# EAGLE design SRAM_MODULE 1.0 (EAGLE 7.1.0)
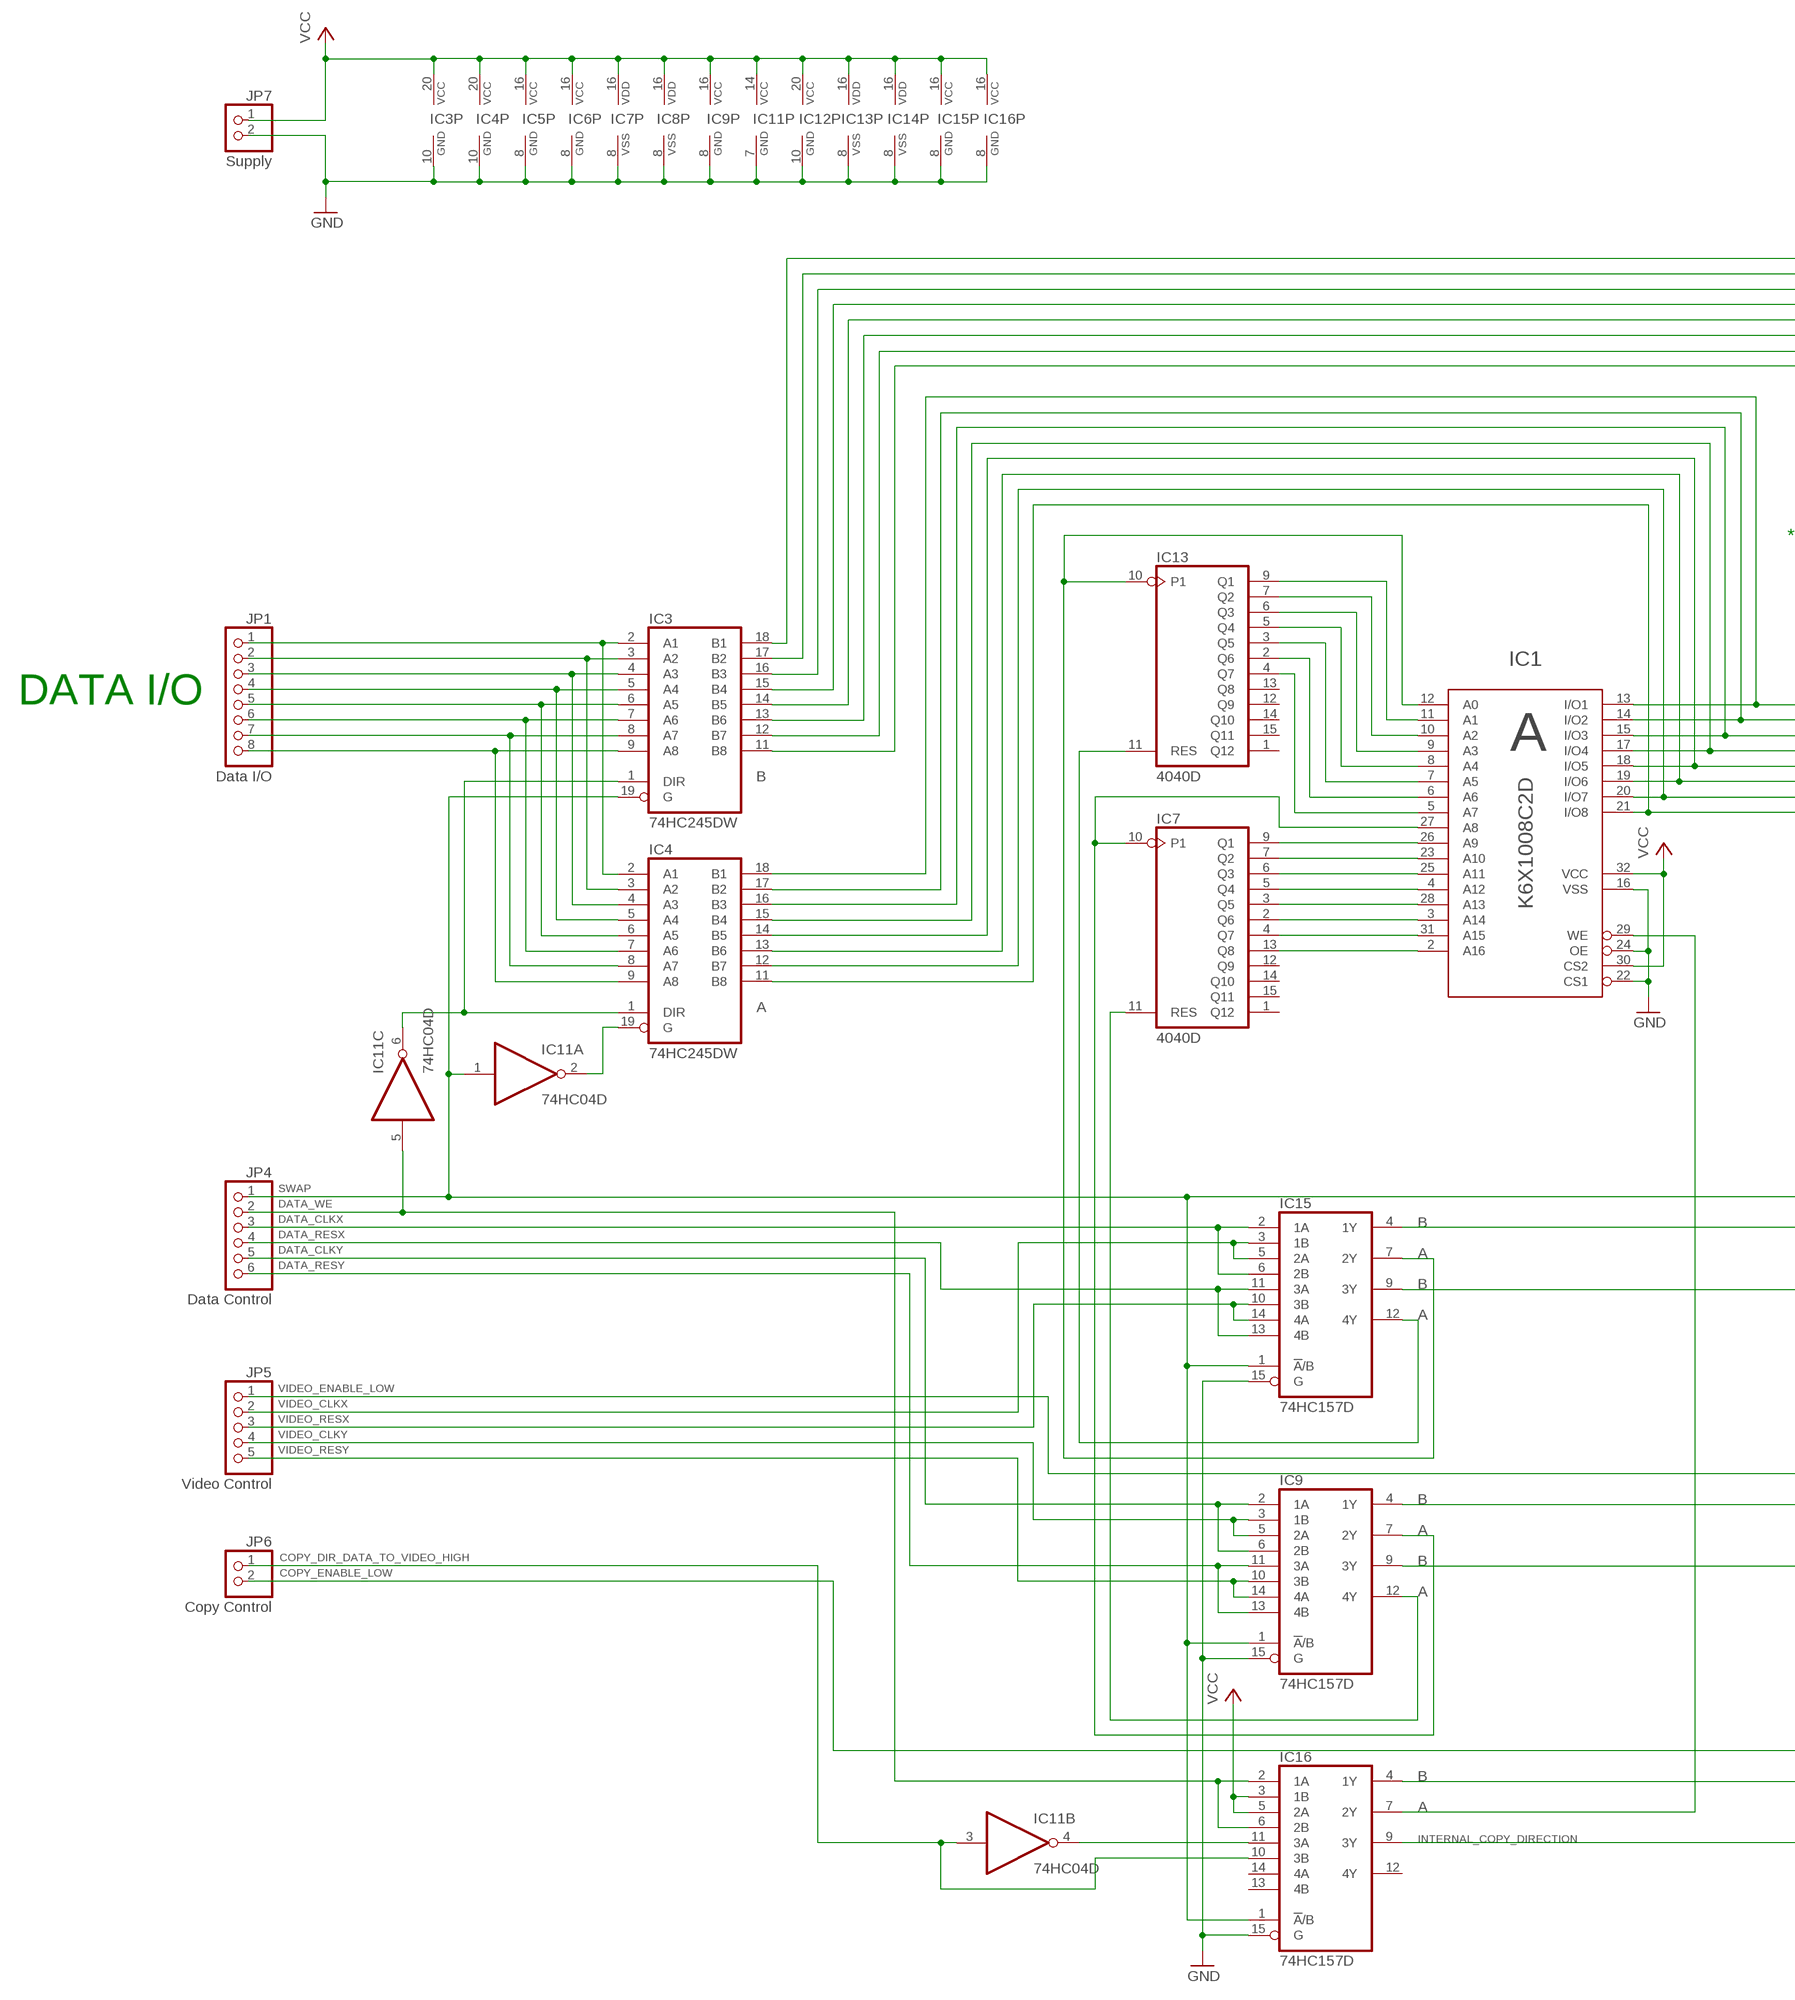
[diagram p0: schematic, sheet 1, part 1 of 2]
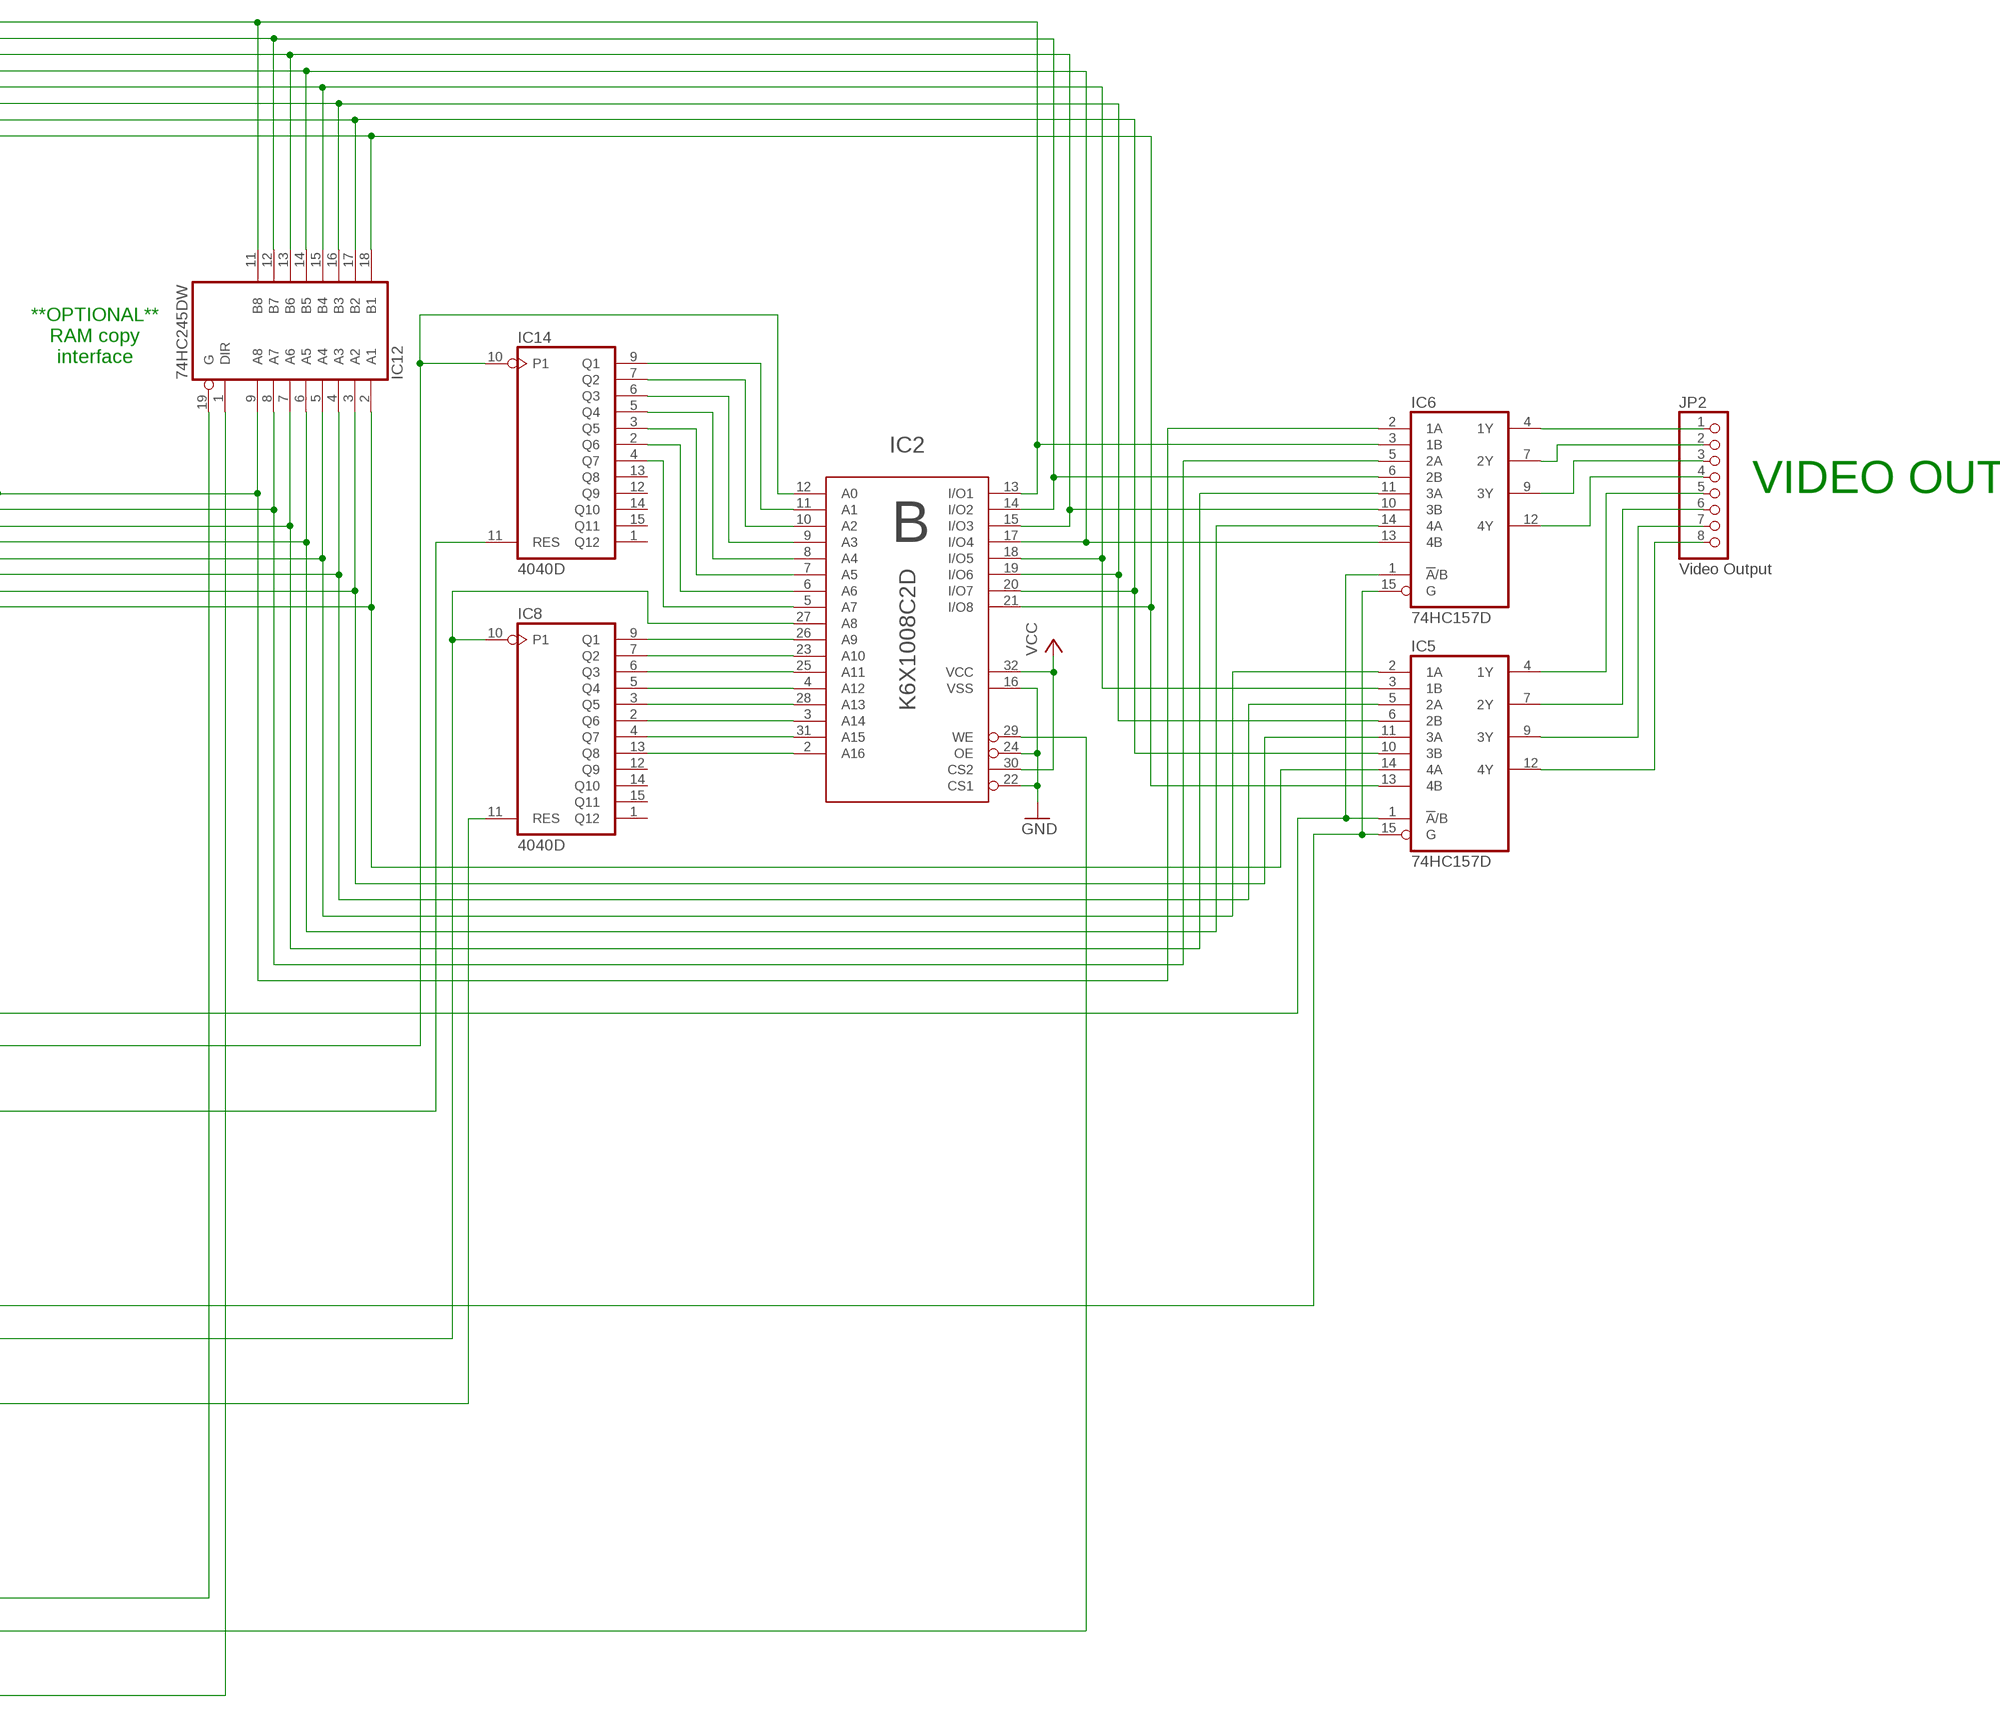
[diagram p1: schematic, sheet 1, part 2 of 2]

## Parts
IC1  K6X1008C2D  [SOP32-5]
IC2  K6X1008C2D  [SOP32-5]
IC3  74HC245DW  [SO20W]
IC4  74HC245DW  [SO20W]
IC5  74HC157D  [SO16]
IC6  74HC157D  [SO16]
IC7  4040D  [SO16]
IC8  4040D  [SO16]
IC9  74HC157D  [SO16]
IC11  74HC04D  [SO14]
IC12  74HC245DW  [SO20W]
IC13  4040D  [SO16]
IC14  4040D  [SO16]
IC15  74HC157D  [SO16]
IC16  74HC157D  [SO16]
JP1  Data I/O  PINHD-1X8  [1X08]
JP2  Video Output  PINHD-1X8  [1X08]
JP4  Data Control  PINHD-1X6  [1X06]
JP5  Video Control  PINHD-1X5  [1X05]
JP6  Copy Control  PINHD-1X2  [1X02]
JP7  Supply  PINHD-1X2  [1X02]

## Nets
A_I/O1: IC1.13(I/O1) IC4.18(B1) IC6.2(1A) IC12.9(A8)
A_I/O2: IC1.14(I/O2) IC4.17(B2) IC6.5(2A) IC12.8(A7)
A_I/O3: IC1.15(I/O3) IC4.16(B3) IC6.11(3A) IC12.7(A6)
A_I/O4: IC1.17(I/O4) IC4.15(B4) IC6.14(4A) IC12.6(A5)
A_I/O5: IC1.18(I/O5) IC4.14(B5) IC5.2(1A) IC12.5(A4)
A_I/O6: IC1.19(I/O6) IC4.13(B6) IC5.5(2A) IC12.4(A3)
A_I/O7: IC1.20(I/O7) IC4.12(B7) IC5.11(3A) IC12.3(A2)
A_I/O8: IC1.21(I/O8) IC4.11(B8) IC5.14(4A) IC12.2(A1)
B_I/O1: IC2.13(I/O1) IC3.18(B1) IC6.3(1B) IC12.11(B8)
B_I/O2: IC2.14(I/O2) IC3.17(B2) IC6.6(2B) IC12.12(B7)
B_I/O3: IC2.15(I/O3) IC3.16(B3) IC6.10(3B) IC12.13(B6)
B_I/O4: IC2.17(I/O4) IC3.15(B4) IC6.13(4B) IC12.14(B5)
B_I/O5: IC2.18(I/O5) IC3.14(B5) IC5.3(1B) IC12.15(B4)
B_I/O6: IC2.19(I/O6) IC3.13(B6) IC5.6(2B) IC12.16(B3)
B_I/O7: IC2.20(I/O7) IC3.12(B7) IC5.10(3B) IC12.17(B2)
B_I/O8: IC2.21(I/O8) IC3.11(B8) IC5.13(4B) IC12.18(B1)
COPY_DIR_DATA_TO_VIDEO_HIGH: IC11.3(B:I) IC16.10(3B) JP6.1
COPY_ENABLE_LOW: IC12.19(G) JP6.2
DATA_CLKX: IC15.2(1A) IC15.6(2B) JP4.3
DATA_CLKY: IC9.2(1A) IC9.6(2B) JP4.5
DATA_RESX: IC15.11(3A) IC15.13(4B) JP4.4
DATA_RESY: IC9.11(3A) IC9.13(4B) JP4.6
DATA_RESY1: IC11.4(B:O) IC16.11(3A)
DATA_WE: IC11.5(C:I) IC16.2(1A) IC16.6(2B) JP4.2
GND: IC1.16(VSS) IC1.22(CS1) IC1.24(OE) IC2.16(VSS) IC2.22(CS1) IC2.24(OE) IC3.10(GND) IC4.10(GND) IC5.8(GND) IC6.8(GND) IC7.8(VSS) IC8.8(VSS) IC9.8(GND) IC9.15(G) IC11.7(P:GND) IC12.10(GND) IC13.8(VSS) IC14.8(VSS) IC15.8(GND) IC15.15(G) IC16.8(GND) IC16.15(G) JP7.2
INTERNAL_COPY_DIRECTION: IC12.1(DIR) IC16.9(3Y)
IO1: IC3.2(A1) IC4.2(A1) JP1.1
IO2: IC3.3(A2) IC4.3(A2) JP1.2
IO3: IC3.4(A3) IC4.4(A3) JP1.3
IO4: IC3.5(A4) IC4.5(A4) JP1.4
IO5: IC3.6(A5) IC4.6(A5) JP1.5
IO6: IC3.7(A6) IC4.7(A6) JP1.6
IO7: IC3.8(A7) IC4.8(A7) JP1.7
IO8: IC3.9(A8) IC4.9(A8) JP1.8
N$17: IC2.25(A11) IC8.6(Q3)
N$18: IC2.23(A10) IC8.7(Q2)
N$19: IC2.4(A12) IC8.5(Q4)
N$20: IC2.26(A9) IC8.9(Q1)
N$21: IC1.12(A0) IC13.10(P1) IC15.7(2Y)
N$22: IC2.3(A14) IC8.2(Q6)
N$23: IC2.28(A13) IC8.3(Q5)
N$24: IC2.31(A15) IC8.4(Q7)
N$25: IC2.2(A16) IC8.13(Q8)
N$26: IC1.25(A11) IC7.6(Q3)
N$27: IC1.27(A8) IC7.10(P1) IC9.7(2Y)
N$28: IC1.4(A12) IC7.5(Q4)
N$31: IC1.3(A14) IC7.2(Q6)
N$32: IC1.28(A13) IC7.3(Q5)
N$33: IC1.31(A15) IC7.4(Q7)
N$34: IC1.2(A16) IC7.13(Q8)
N$35: IC7.11(RES) IC9.12(4Y)
N$36: IC8.11(RES) IC9.9(3Y)
N$37: IC1.9(A3) IC13.6(Q3)
N$38: IC2.27(A8) IC8.10(P1) IC9.4(1Y)
N$39: IC1.26(A9) IC7.9(Q1)
N$40: IC1.29(WE) IC16.7(2Y)
N$41: IC1.23(A10) IC7.7(Q2)
N$43: IC3.1(DIR) IC4.1(DIR) IC11.6(C:O)
N$45: IC4.19(G) IC11.2(A:O)
N$47: IC2.29(WE) IC16.4(1Y)
N$71: IC1.11(A1) IC13.9(Q1)
N$73: IC1.8(A4) IC13.5(Q4)
N$74: IC1.7(A5) IC13.3(Q5)
N$75: IC1.6(A6) IC13.2(Q6)
N$76: IC1.5(A7) IC13.4(Q7)
N$77: IC1.10(A2) IC13.7(Q2)
N$78: IC2.12(A0) IC14.10(P1) IC15.4(1Y)
N$79: IC2.11(A1) IC14.9(Q1)
N$80: IC2.10(A2) IC14.7(Q2)
N$81: IC2.9(A3) IC14.6(Q3)
N$82: IC2.8(A4) IC14.5(Q4)
N$83: IC2.7(A5) IC14.3(Q5)
N$84: IC2.6(A6) IC14.2(Q6)
N$85: IC2.5(A7) IC14.4(Q7)
N$87: IC14.11(RES) IC15.9(3Y)
N$88: IC13.11(RES) IC15.12(4Y)
O1: IC6.4(1Y) JP2.1
O2: IC6.7(2Y) JP2.2
O3: IC6.9(3Y) JP2.3
O4: IC6.12(4Y) JP2.4
O5: IC5.4(1Y) JP2.5
O6: IC5.7(2Y) JP2.6
O7: IC5.9(3Y) JP2.7
O8: IC5.12(4Y) JP2.8
SWAP: IC3.19(G) IC5.1(!A!/B) IC6.1(!A!/B) IC9.1(!A!/B) IC11.1(A:I) IC15.1(!A!/B) IC16.1(!A!/B) JP4.1
VCC: IC1.30(CS2) IC1.32(VCC) IC2.30(CS2) IC2.32(VCC) IC3.20(VCC) IC4.20(VCC) IC5.16(VCC) IC6.16(VCC) IC7.16(VDD) IC8.16(VDD) IC9.16(VCC) IC11.14(P:VCC) IC12.20(VCC) IC13.16(VDD) IC14.16(VDD) IC15.16(VCC) IC16.3(1B) IC16.5(2A) IC16.16(VCC) JP7.1
VIDEO_CLKX: IC15.3(1B) IC15.5(2A) JP5.2
VIDEO_CLKY: IC9.3(1B) IC9.5(2A) JP5.4
VIDEO_ENABLE_LOW: IC5.15(G) IC6.15(G) JP5.1
VIDEO_RESX: IC15.10(3B) IC15.14(4A) JP5.3
VIDEO_RESY: IC9.10(3B) IC9.14(4A) JP5.5
Unconnected: IC7.1(Q12) IC7.12(Q9) IC7.14(Q10) IC7.15(Q11) IC8.1(Q12) IC8.12(Q9) IC8.14(Q10) IC8.15(Q11) IC11.8(D:O) IC11.9(D:I) IC11.10(E:O) IC11.11(E:I) IC11.12(F:O) IC11.13(F:I) IC13.1(Q12) IC13.12(Q9) IC13.13(Q8) IC13.14(Q10) IC13.15(Q11) IC14.1(Q12) IC14.12(Q9) IC14.13(Q8) IC14.14(Q10) IC14.15(Q11) IC16.12(4Y) IC16.13(4B) IC16.14(4A)

## Notes on the sheet
- **OPTIONAL**
  RAM copy
  interface
- DATA I/O | VIDEO OUT
- A | B
- B
- A
- B
- A
- B
- A
- B
- A
- B
- A
- B
- A

## Library data of the parts
IC1 IC2 = SRAM:K6X1008C2D: Static RAM SOP32-5; IC1: K6X1008C2D-B
IC3 IC4 IC12 = 74xx-eu:74*245: Octal BUS TRANSCEIVER, 3-state
IC5 IC6 IC9 IC15 IC16 = 74xx-eu:74*157: Quadruple 2-line to 1-line data SELECTOR/MULTIPLEXER
IC7 IC8 IC13 IC14 = 40xx:4040: 12-stage binary/ripple COUNTER
IC11 = 74xx-eu:74*04: Hex INVERTER
JP1 JP2 = pinhead:PINHD-1X8: PIN HEADER
JP4 = pinhead:PINHD-1X6: PIN HEADER
JP5 = pinhead:PINHD-1X5: PIN HEADER
JP6 JP7 = pinhead:PINHD-1X2: PIN HEADER

## Board
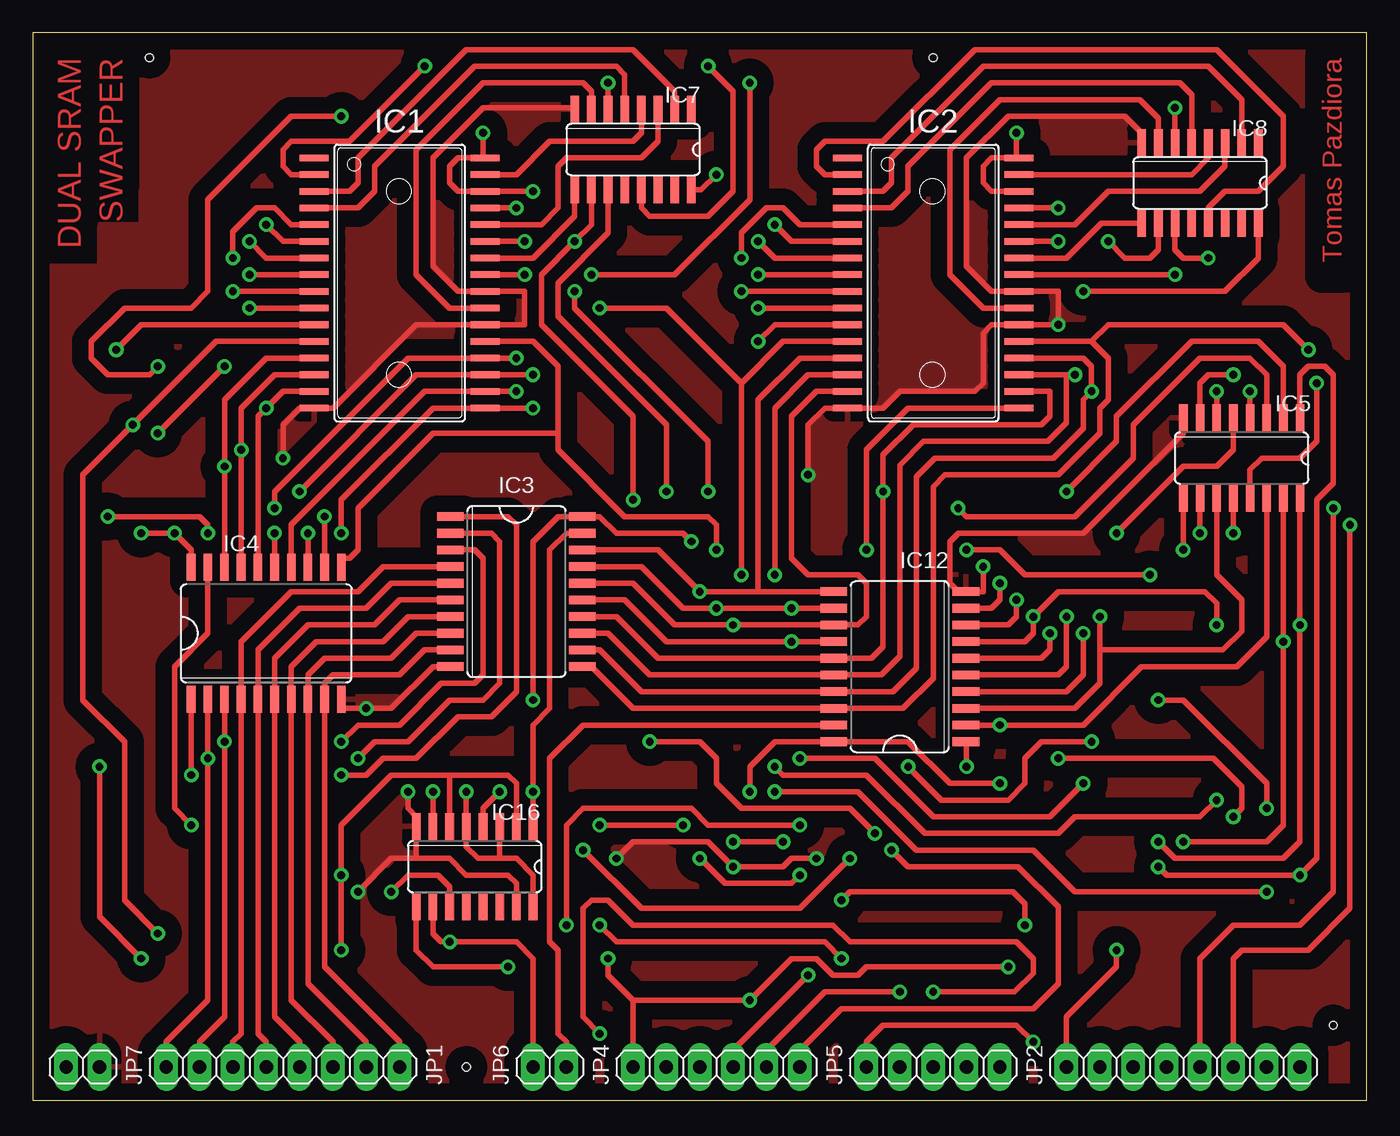
[diagram p2: board, top side]
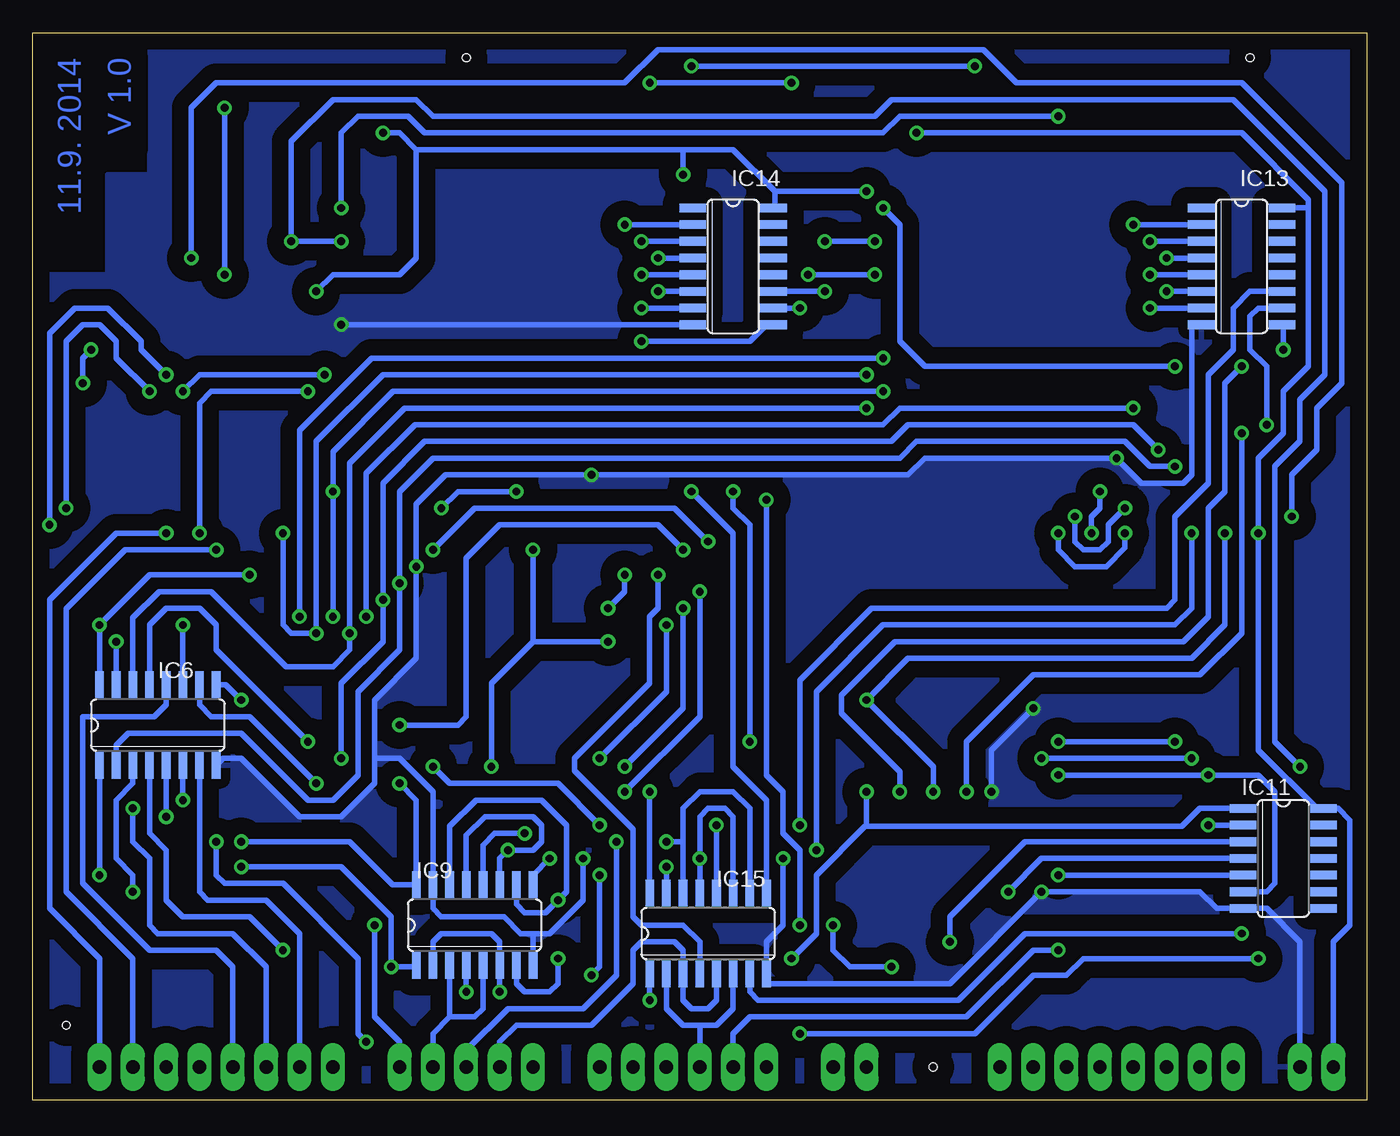
[diagram p3: board, bottom side, seen from below]

Size 101.6 x 81.28 mm. Coordinates in mm from the lower left corner, seen from the top.
Outline: 0,0 101.6,0 101.6,81.28 0,81.28 0,0
Copper layers (1*16): Top 0.035mm / dielectric 1.5mm / Bottom 0.035mm
Design rules "Aroidzap_DesignRules": minimum track width 16mil, minimum drill 0.6mm, track to track 20mil, track to pad 20mil, pad to pad 20mil, via to via 20mil, smd to smd 16mil, copper to edge 20mil, drill to drill 40mil, minimum pad ring 16mil, minimum via ring 10mil, stop-mask expansion 4mil, vias tented up to drill 0mil, thermal gap 30mil
Holes 0.6 mm at 8.89,79.38 68.58,79.38 99.06,5.71 33.02,2.54

### Footprints (pad centres in the part's own frame; a part is rotated, then mirrored left to right if it is on the bottom)
SOP32-5 = smd 0.5 x 2.2: 1 -9.525,-6.516; 2 -8.255,-6.516; 3 -6.985,-6.516; 4 -5.715,-6.516; 5 -4.445,-6.516; 6 -3.175,-6.516; 7 -1.905,-6.516; 8 -0.635,-6.516; 9 0.635,-6.516; 10 1.905,-6.516; 11 3.175,-6.516; 12 4.445,-6.516; 13 5.715,-6.516; 14 6.985,-6.516; 15 8.255,-6.516; 16 9.525,-6.516; 17 9.525,6.516; 18 8.255,6.516; 19 6.985,6.516; 20 5.715,6.516; 21 4.445,6.516; 22 3.175,6.516; 23 1.905,6.516; 24 0.635,6.516; 25 -0.635,6.516; 26 -1.905,6.516; 27 -3.175,6.516; 28 -4.445,6.516; 29 -5.715,6.516; 30 -6.985,6.516; 31 -8.255,6.516; 32 -9.525,6.516
SO20W = smd 0.66 x 2.032: 1 -5.715,-5.029; 2 -4.445,-5.029; 3 -3.175,-5.029; 4 -1.905,-5.029; 5 -0.635,-5.029; 6 0.635,-5.029; 7 1.905,-5.029; 8 3.175,-5.029; 9 4.445,-5.029; 10 5.715,-5.029; 11 5.715,5.029; 12 4.445,5.029; 13 3.175,5.029; 14 1.905,5.029; 15 0.635,5.029; 16 -0.635,5.029; 17 -1.905,5.029; 18 -3.175,5.029; 19 -4.445,5.029; 20 -5.715,5.029
SO16 = smd 0.66 x 2.032: 1 -4.445,-3.073; 2 -3.175,-3.073; 3 -1.905,-3.073; 4 -0.635,-3.073; 5 0.635,-3.073; 6 1.905,-3.073; 7 3.175,-3.073; 8 4.445,-3.073; 9 4.445,3.073; 10 3.175,3.073; 11 1.905,3.073; 12 0.635,3.073; 13 -0.635,3.073; 14 -1.905,3.073; 15 -3.175,3.073; 16 -4.445,3.073
SO14 = smd 0.66 x 2.032: 1 -3.81,-3.073; 2 -2.54,-3.073; 3 -1.27,-3.073; 4 0,-3.073; 5 1.27,-3.073; 6 2.54,-3.073; 7 3.81,-3.073; 8 3.81,3.073; 9 2.54,3.073; 10 1.27,3.073; 11 0,3.073; 12 -1.27,3.073; 13 -2.54,3.073; 14 -3.81,3.073
1X08 = drill 1.016 long: 1 -8.89,0; 2 -6.35,0; 3 -3.81,0; 4 -1.27,0; 5 1.27,0; 6 3.81,0; 7 6.35,0; 8 8.89,0
1X06 = drill 1.016 long: 1 -6.35,0; 2 -3.81,0; 3 -1.27,0; 4 1.27,0; 5 3.81,0; 6 6.35,0
1X05 = drill 1.016 long: 1 -5.08,0; 2 -2.54,0; 3 0,0; 4 2.54,0; 5 5.08,0
1X02 = drill 1.016 long: 1 -1.27,0; 2 1.27,0

### Placement (x,y rotation side)
IC1  27.94,62.23 270 top
IC2  68.58,62.23 270 top
IC3  36.83,38.73 270 top
IC4  17.78,35.56 0 top
IC5  92.08,48.9 180 top
IC6  92.08,28.57 0 bottom
IC7  45.72,72.39 180 top
IC8  88.9,69.85 180 top
IC9  67.94,13.34 0 bottom
IC11  6.35,18.41 270 bottom
IC12  66.04,33.02 90 top
IC13  9.53,63.5 270 bottom
IC14  48.26,63.5 270 bottom
IC15  50.16,12.7 0 bottom
IC16  33.66,17.78 180 top
JP1  19.05,2.54 0 top
JP2  87.63,2.54 0 top
JP4  52.07,2.54 0 top
JP5  68.58,2.54 0 top
JP6  39.37,2.54 0 top
JP7  3.81,2.54 0 top

### Tracks (layer width: path | path; a pad name or v marks a point on that pad's centre or on a via)
A_I/O1  (via drill 0.6 pad 0.61)
  Top 0.406: IC4.18 v14.61,48.26 14.61,53.34 17.78,56.52 IC1.13 | IC12.9 73.03,37.47 73.66,38.1 v73.66,39.37
  Bottom 0.406: v14.61,48.26 16.51,48.26 18.41,50.16 34.29,50.16 35.56,48.9 71.12,48.9 73.66,46.35 v73.66,39.37 73.66,34.29 76.83,31.11 76.83,24.77 78.74,22.86 80.64,22.86 85.72,27.94 94.35,27.94 95.25,27.04 IC6.2
A_I/O2  (via drill 0.6, 0.6 pad 0.61)
  Top 0.406: IC1.14 18.41,55.24 15.88,52.7 v15.88,49.53 IC4.17 | IC12.8 74.3,36.2 74.93,36.83 v74.93,38.1 | v91.44,21.59 92.08,22.23 92.08,23.87 89.91,26.04 v78.11,26.04
  Bottom 0.406: v15.88,49.53 17.78,51.44 34.92,51.44 36.2,50.16 71.75,50.16 74.93,46.99 v74.93,38.1 74.93,34.92 78.11,31.75 v78.11,26.04 | IC6.5 v91.44,21.59
A_I/O3  (via drill 0.6, 0.6 pad 0.61)
  Top 0.406: IC1.15 19.05,53.98 v17.78,52.7 17.14,52.07 IC4.16 | IC12.7 75.56,34.92 76.2,35.56 v76.2,36.83 78.11,38.73 89.27,38.73 90.17,37.84 v90.17,36.2
  Bottom 0.406: v76.2,36.83 76.2,47.73 72.5,51.44 36.83,51.44 35.56,52.7 v17.78,52.7 | IC6.11 v90.17,36.2
A_I/O4  (via drill 0.6, 0.6 pad 0.61)
  Top 0.406: v23.5,43.18 23.5,45.72 30.48,52.7 IC1.17 v38.1,52.7 | v18.41,43.18 IC4.15 | IC12.6 76.83,33.66 77.47,34.29 v77.47,35.56
  Bottom 0.406: v18.41,43.18 18.41,42.06 19.84,40.64 22.23,40.64 23.5,41.91 v23.5,43.18 | IC6.14 93.98,36.73 91.97,38.73 88,38.73 82.29,33.02 78.74,33.02 77.47,34.29 v77.47,35.56 77.47,48.51 73.28,52.7 v38.1,52.7
A_I/O5  (via drill 0.6, 0.6 pad 0.61)
  Top 0.406: IC4.14 19.68,43.81 29.84,53.98 IC1.18 v36.83,53.98 | IC12.5 78.11,32.38 78.74,33.02 v78.74,36.83 | IC5.2 95.25,55.88 93.34,57.78 88.27,57.78 82.55,52.07 82.55,50.16 v78.74,46.35
  Bottom 0.406: v78.74,36.83 v78.74,46.35 78.74,49.38 74.14,53.98 v36.83,53.98
A_I/O6  (via drill 0.6, 0.6 pad 0.61)
  Top 0.406: v20.95,43.18 IC4.13 | v20.32,46.35 29.21,55.24 IC1.19 v38.1,55.24 | IC12.4 78.74,31.11 80.01,32.38 v80.01,35.56 | IC5.5 91.44,49.53 90.17,48.26 87.63,48.26 v82.55,43.18
  Bottom 0.406: v20.95,43.18 20.95,44.45 20.32,45.09 v20.32,46.35 | v82.55,43.18 82.55,36.2 81.92,35.56 v80.01,35.56 80.01,50.16 74.93,55.24 v38.1,55.24
A_I/O7  (via drill 0.6 pad 0.61)
  Top 0.406: v18.41,45.09 18.41,46.35 28.57,56.52 IC1.20 v36.83,56.52 | IC4.12 v22.23,44.45 | IC12.3 79.38,29.84 81.28,31.75 81.28,34.29 | v81.28,36.83 81.28,34.29 | IC5.11 90.17,40.01 92.08,38.1 92.08,35.71 90.66,34.29 81.28,34.29
  Bottom 0.406: v81.28,36.83 81.28,51.02 75.78,56.52 v36.83,56.52 | v18.41,45.09 19.68,43.81 19.68,42.55 20.32,41.91 21.59,41.91 22.23,42.55 v22.23,44.45
A_I/O8  (via drill 0.6)
  Top 0.406: IC1.21 38.1,57.78 40.01,55.88 40.01,50.8 | 40.01,50.8 30.48,50.8 24.77,45.09 24.77,41.91 24.13,41.27 23.5,41.27 IC4.11 | IC5.14 93.98,35.31 91.69,33.02 84.45,33.02 80.01,28.57 v73.66,28.57 IC12.2 | v52.07,41.91 52.07,43.81 51.44,44.45 45.09,44.45 40.01,49.53 40.01,50.8
  Bottom 0.406: v73.66,28.57 69.22,28.57 68.58,29.21 68.58,41.27 66.04,43.81 53.98,43.81 v52.07,41.91
B_I/O1  (via drill 0.6)
  Top 0.406: IC3.18 47.62,41.91 v50.8,38.73 55.24,38.73 | IC2.13 58.42,56.52 55.24,53.34 55.24,38.73 | 55.24,38.73 IC12.11 | v56.52,23.5 62.87,23.5 67.31,19.05 76.2,19.05 79.38,15.88 v93.98,15.88
  Bottom 0.406: IC6.3 93.98,24.13 95.25,22.86 95.25,18.41 93.98,17.14 v93.98,15.88 | v56.52,23.5 50.8,29.21 v50.8,38.73
B_I/O2  (via drill 0.6, 0.6 pad 0.61)
  Top 0.406: IC3.17 46.35,40.64 49.53,37.47 v52.07,37.47 v57.78,37.47 IC12.12 | IC2.14 59.05,55.24 56.52,52.7 v56.52,40.01 | v90.17,22.86 88.9,21.59 79.38,21.59 78.11,20.32 67.94,20.32 63.5,24.77 57.15,24.77 v56.52,25.4
  Bottom 0.406: v56.52,40.01 56.52,38.73 v57.78,37.47 | IC6.6 v90.17,22.86 | v56.52,25.4 52.07,29.84 v52.07,37.47
B_I/O3  (via drill 0.6)
  Top 0.406: IC3.16 45.72,39.37 48.9,36.2 v53.34,36.2 IC12.13 62.87,36.2 63.5,36.83 63.5,39.37 62.87,40.01 59.05,40.01 57.78,41.27 57.78,52.07 59.69,53.98 IC2.15 | v80.01,24.13 77.47,21.59 68.58,21.59 64.14,26.04 v58.42,26.04
  Bottom 0.406: IC6.10 88.9,30.11 88,29.21 85.09,29.21 v80.01,24.13 | v58.42,26.04 53.34,31.11 v53.34,36.2
B_I/O4  (via drill 0.6)
  Top 0.406: IC3.15 45.09,38.1 48.26,34.92 v57.78,34.92 IC12.14 | IC2.17 66.67,52.7 63.5,49.53 v63.5,41.91 | v66.67,25.4 69.22,22.86 74.3,22.86 75.56,24.13 75.56,26.04 76.83,27.3 v80.64,27.3
  Bottom 0.406: v63.5,41.91 63.5,34.92 | 63.5,34.92 v57.78,34.92 | 63.5,34.92 66.67,31.75 v66.67,25.4 | IC6.13 92.71,36.2 91.44,37.47 88.9,37.47 87.63,36.2 87.63,34.29 v80.64,27.3
B_I/O5  (via drill 0.6)
  Top 0.406: IC3.14 44.45,36.83 47.62,33.66 IC12.15 63.87,33.66 64.77,34.55 v64.77,46.35 64.77,49.15 67.06,51.44 76.83,51.44 77.47,52.07 77.47,53.98 IC2.18 | IC5.3 93.98,55.24 92.71,56.52 88.9,56.52 83.82,51.44 83.82,48.9 79.38,44.45 71.12,44.45 v70.48,45.09
  Bottom 0.406: v70.48,45.09 69.22,46.35 v64.77,46.35
B_I/O6  (via drill 0.6)
  Top 0.406: IC3.13 43.81,35.56 46.99,32.38 IC12.16 64.62,32.38 66.04,33.8 66.04,48.37 67.84,50.16 77.32,50.16 78.74,51.59 78.74,55.24 v79.38,55.24 IC2.19 | 90.17,51.44 IC5.6 v90.17,53.98
  Bottom 0.406: v90.17,53.98 88.9,55.24 v79.38,55.24
B_I/O7  (via drill 0.6)
  Top 0.406: IC3.12 43.18,34.29 46.35,31.11 IC12.17 65.51,31.11 67.31,32.91 67.31,47.48 68.73,48.9 77.72,48.9 80.01,51.19 80.01,53.34 v80.64,53.98 80.64,55.88 80.01,56.52 IC2.20 | IC5.10 v88.9,43.18
  Bottom 0.406: v88.9,43.18 88.9,53.08 88,53.98 v80.64,53.98
B_I/O8  (via drill 0.6)
  Top 0.406: IC3.11 42.55,33.02 45.72,29.84 IC12.18 66.29,29.84 68.58,32.13 68.58,46.73 69.48,47.62 78.11,47.62 81.28,50.8 81.28,52.7 81.92,53.34 81.92,56.52 80.64,57.78 | IC5.13 92.71,48 93.61,48.9 96.52,48.9 97.79,50.16 v97.79,54.61 | v97.16,57.15 95.25,59.05 81.92,59.05 80.64,57.78 | IC2.21 80.64,57.78
  Bottom 0.406: v97.79,54.61 97.79,56.52 v97.16,57.15
COPY_DIR_DATA_TO_VIDEO_HIGH  (via drill 0.6)
  Top 0.406: IC16.10 30.48,12.7 31.11,12.06 v31.75,12.06 36.83,12.06 38.1,10.79 JP6.1
  Bottom 0.406: IC11.3 26.04,19.68 31.75,13.97 v31.75,12.06
COPY_ENABLE_LOW
  Top 0.406: JP6.2 40.64,4.45 40.01,5.08 40.01,11.43 39.37,12.06 39.37,26.04 41.91,28.57 IC12.19
DATA_CLKX
  Bottom 0.406: IC15.6 48.26,6.99 49.53,5.71 50.8,5.71 | 50.8,5.71 52.07,5.71 53.34,6.99 IC15.2 | JP4.3 50.8,5.71
DATA_CLKY  (via drill 0.6)
  Top 0.406: JP4.5 55.88,3.81 60.33,8.26 v66.04,8.26
  Bottom 0.406: v66.04,8.26 IC9.6 66.04,12.06 66.67,12.7 70.48,12.7 71.12,12.06 IC9.2
DATA_RESX  (via drill 0.6)
  Top 0.406: v50.8,18.41 52.7,16.51 57.78,16.51 v58.42,17.14 | JP4.4 53.34,3.81 v59.05,9.53
  Bottom 0.406: IC15.11 48.26,21.59 48.9,22.23 50.16,22.23 50.8,21.59 v50.8,18.41 IC15.13 | v58.42,17.14 58.42,10.16 v59.05,9.53
DATA_RESY  (via drill 0.6)
  Top 0.406: v65.41,19.05 66.67,17.78 75.05,17.78 78.11,14.72 78.11,8.89 76.2,6.99 61.59,6.99 58.42,3.81 JP4.6
  Bottom 0.406: IC9.13 68.58,20.17 67.16,21.59 63.5,21.59 62.87,20.95 62.87,19.68 63.5,19.05 v65.41,19.05 66.04,18.41 IC9.11
DATA_RESY1  (via drill 0.6)
  Top 0.406: IC16.11 31.75,16.25 30.85,17.14 28.57,17.14 v27.3,15.88
  Bottom 0.406: IC11.4 24.77,18.41 v27.3,15.88
DATA_WE  (via drill 0.6)
  Top 0.406: 31.75,24.77 27.3,24.77 23.5,20.95 v23.5,17.14 v23.5,11.43 | 31.75,24.77 IC16.6 | IC16.2 36.83,24.13 36.2,24.77 31.75,24.77
  Bottom 0.406: IC11.5 v23.5,17.14 | JP4.2 48.26,5.08 46.99,6.35 30.48,6.35 25.4,11.43 v23.5,11.43
GND  (via drill 0.6, 0.6 pad 0.61)
  Top 0.406: IC4.10 23.5,29.84 v25.4,29.84 27.3,29.84 30.48,33.02 IC3.10 | v72.39,40.64 72.39,38.73 IC12.10 70.48,38.73 69.85,39.37 69.85,42.55 70.48,43.18 80.01,43.18 87.63,50.8 IC5.8 | v19.05,48.9 19.05,51.44 20.32,52.7 IC1.16 22.86,52.7 29.21,59.05 IC1.22 37.47,59.05 37.47,61.59 IC1.24 32.38,61.59 30.48,63.5 30.48,71.75 34.29,75.56 41.17,75.56 IC7.8 | v59.05,47.62 59.05,51.44 60.33,52.7 IC2.16 64.77,52.7 66.04,53.98 71.75,53.98 72.39,54.61 72.39,58.42 73.03,59.05 IC2.22 v78.11,59.05 78.11,61.59 IC2.24 73.03,61.59 71.12,63.5 71.12,71.75 74.3,74.93 83.19,74.93 84.45,73.66 IC8.8 | 29.21,18.41 27.3,18.41 v24.77,15.88 | 29.21,18.41 31.75,18.41 33.02,17.14 36.2,17.14 36.83,16.51 IC16.15 | v28.57,23.5 28.57,22.23 29.21,21.59 IC16.8 29.21,18.41 | v44.45,18.41 45.72,19.68 51.44,19.68 v53.34,17.78 57.15,17.78 57.78,18.41 v59.69,18.41
  Bottom 0.406: IC6.8 87.1,26.04 85.72,26.04 81.28,21.59 78.11,21.59 75.56,24.13 75.56,26.04 | JP7.2 5.08,12.06 7.62,14.61 IC11.7 11.43,14.61 12.7,15.88 v24.77,15.88 31.75,8.89 45.62,8.89 45.62,9.53 IC15.8 45.72,12.06 44.45,13.34 v44.45,18.41 | IC14.8 v78.11,59.05 | 75.56,26.04 75.56,30.48 72.39,33.66 v72.39,40.64 72.39,45.4 70.17,47.62 v59.05,47.62 34.92,47.62 33.66,48.9 v19.05,48.9 17.14,46.99 13.97,46.99 13.34,47.62 13.34,58.95 13.23,59.05 IC13.8 | v25.4,29.84 28.57,26.67 v28.57,23.5 | IC15.15 v53.34,17.78 | 75.56,26.04 73.66,26.04 71.12,23.5 IC9.15 71.12,14.61 70.48,13.97 65.72,13.97 64.45,12.7 63.5,12.7 | 63.4,10.16 IC9.8 63.5,12.7 | v59.69,18.41 59.69,15.24 62.23,12.7 63.5,12.7
  pour Top (isolate 1.27): 8.26,66.67 8.26,81.28 101.6,81.28 101.6,0 0,0 0,63.5 5.08,63.5 5.08,66.67
  pour Bottom (isolate 1.27): 0,81.28 92.71,81.28 92.71,70.48 95.89,70.48 95.89,62.87 101.6,62.87 101.6,0 0,0
INTERNAL_COPY_DIRECTION  (via drill 0.6)
  Top 0.406: IC16.9 29.21,11.43 30.48,10.16 v36.2,10.16 | v58.42,20.95 51.44,20.95 50.16,22.23 41.91,22.23 40.64,20.95 v40.64,13.34 | v71.12,25.4 71.12,27.25 IC12.1
  Bottom 0.406: v58.42,20.95 61.59,24.13 69.85,24.13 v71.12,25.4 | v40.64,13.34 40.64,11.43 39.37,10.16 v36.2,10.16
IO1  (via drill 0.6 pad 0.61)
  Top 0.406: IC4.2 v13.34,26.04 13.34,7.62 10.16,4.45 JP1.1 | IC3.2 34.92,43.18 35.56,42.55 35.56,31.75 34.29,30.48 31.75,30.48 28.57,27.3 26.04,27.3 v24.77,26.04
  Bottom 0.406: v24.77,26.04 v13.34,26.04
IO2  (via drill 0.6 pad 0.61)
  Top 0.406: JP1.2 12.7,4.45 14.61,6.35 v14.61,27.3 IC4.3 | IC3.3 33.66,41.91 34.29,41.27 34.29,32.38 33.66,31.75 31.11,31.75 27.94,28.57 24.77,28.57 v23.5,27.3
  Bottom 0.406: v23.5,27.3 v14.61,27.3
IO3
  Top 0.406: JP1.3 15.24,4.45 15.88,5.08 IC4.4 15.88,34.92 19.68,38.73 24.77,38.73 26.67,40.64 IC3.4
IO4
  Top 0.406: JP1.4 17.78,4.45 17.14,5.08 IC4.5 17.14,34.29 20.32,37.47 25.4,37.47 27.3,39.37 IC3.5
IO5
  Top 0.406: JP1.5 20.32,4.45 18.41,6.35 IC4.6 18.41,33.66 20.95,36.2 26.04,36.2 27.94,38.1 IC3.6
IO6
  Top 0.406: JP1.6 22.86,4.45 19.68,7.62 IC4.7 19.68,33.02 21.59,34.92 26.67,34.92 28.57,36.83 IC3.7
IO7
  Top 0.406: JP1.7 25.4,4.45 20.95,8.89 IC4.8 20.95,32.38 22.23,33.66 27.3,33.66 29.21,35.56 IC3.8
IO8
  Top 0.406: IC3.9 29.84,34.29 27.94,32.38 22.86,32.38 22.23,31.75 IC4.9 22.23,10.16 27.94,4.45 JP1.8
N$17  (via drill 0.6)
  Top 0.406: IC2.25 v87,62.87 | IC8.6 v87,75.56
  Bottom 0.406: v87,62.87 v87,75.56
N$18
  Top 0.406: IC2.23 72.39,60.33 69.85,62.87 69.85,72.39 73.66,76.2 84.31,76.2 85.72,74.78 IC8.7
N$19
  Top 0.406: IC2.4 65.41,67.94 66.67,69.22 66.67,71.12 73.03,77.47 87.37,77.47 88.27,76.57 IC8.5
N$20
  Top 0.406: IC2.26 78.74,64.14 81.38,66.78 IC8.9
N$21  (via drill 0.6, 0.6 pad 0.61)
  Top 0.406: IC1.12 13.97,57.78 v7.62,51.44 3.81,47.62 3.81,30.48 6.99,27.3 6.99,15.24 v9.53,12.7
  Bottom 0.406: v9.53,12.7 26.04,12.7 31.11,7.62 46.35,7.62 46.99,8.26 IC15.7 | IC13.10 8.26,60.33 8.89,59.69 8.89,57.15 7.62,55.88 v7.62,51.44
N$22
  Top 0.406: IC2.3 64.77,69.22 65.41,69.85 65.41,71.75 72.39,78.74 89.53,78.74 92.08,76.2 IC8.2
N$23
  Top 0.406: IC2.28 79.38,66.67 81.92,69.22 88.9,69.22 90.81,71.12 IC8.3
N$24
  Top 0.406: IC2.31 88.27,70.48 89.53,71.75 IC8.4
N$25
  Top 0.406: IC2.2 60.33,70.48 59.69,71.12 59.69,72.39 60.33,73.03 64.77,73.03 71.75,80.01 90.17,80.01 95.25,74.93 95.25,71.12 93.34,69.22 90.81,69.22 89.53,67.94 IC8.13
N$26  (via drill 0.6)
  Top 0.406: v54.61,77.47 54.61,68.58 48.9,62.87 v42.55,62.87 | IC7.6 v43.81,77.47 | IC1.25 v37.47,62.87
  Bottom 0.406: v43.81,77.47 v54.61,77.47 | v37.47,62.87 v42.55,62.87
N$27  (via drill 0.6, 0.6 pad 0.61)
  Top 0.406: IC1.27 v37.47,65.41 | IC7.10 42.55,66.67 v41.27,65.41 38.73,62.87 38.73,59.05 45.72,52.07 v45.72,45.72 | v43.18,13.34 44.45,12.06 60.33,12.06 v61.59,10.79
  Bottom 0.406: v37.47,65.41 v41.27,65.41 | v45.72,45.72 45.72,24.77 44.45,23.5 44.45,20.32 43.18,19.05 v43.18,13.34 | IC9.7 64.77,8.89 64.14,8.26 62.23,8.26 61.59,8.89 v61.59,10.79
N$28
  Top 0.406: IC1.4 24.77,67.94 26.04,69.22 26.04,71.12 33.66,78.74 44.45,78.74 45.09,78.11 IC7.5
N$31
  Top 0.406: IC1.3 24.13,69.22 24.77,69.85 24.77,71.75 33.02,80.01 45.72,80.01 48.9,76.83 IC7.2
N$32
  Top 0.406: IC1.28 38.73,66.67 40.01,67.94 40.01,71.12 40.64,71.75 46.35,71.75 47.62,73.03 IC7.3
N$33
  Top 0.406: IC1.31 36.83,70.48 39.37,73.03 45.72,73.03 46.35,73.66 IC7.4
N$34  (via drill 0.6)
  Top 0.406: IC1.2 19.68,70.48 19.05,71.12 19.05,72.39 19.68,73.03 24.13,73.03 v29.84,78.74 | IC7.13 46.35,67.94 46.99,67.31 51.44,67.31 53.34,69.22 53.34,76.83 v51.44,78.74
  Bottom 0.406: v51.44,78.74 v29.84,78.74
N$35  (via drill 0.6)
  Top 0.406: IC7.11 43.81,66.04 40.01,62.23 40.01,59.69 48.26,51.44 v48.26,46.35 | v46.99,27.3 50.8,27.3 52.07,26.04 52.07,24.13 53.98,22.23 62.23,22.23 v64.14,20.32
  Bottom 0.406: IC9.12 67.31,19.42 66.41,20.32 v64.14,20.32 | v48.26,46.35 48.26,45.09 46.99,43.81 v46.99,27.3
N$36  (via drill 0.6)
  Top 0.406: v62.23,18.41 58.42,14.61 46.35,14.61 v41.91,19.05 | IC8.11 87,64.77 87.63,64.14 v89.53,64.14 | v5.71,44.45 12.7,44.45 13.34,43.81 v13.34,43.18
  Bottom 0.406: v62.23,18.41 63.5,17.14 IC9.9 | v41.91,19.05 41.91,31.11 36.83,36.2 14.61,36.2 13.34,37.47 v13.34,43.18 | v89.53,64.14 89.53,75.56 87.63,77.47 56.52,77.47 53.98,80.01 29.21,80.01 26.67,77.47 9.53,77.47 1.91,69.85 1.91,54.61 3.81,52.7 3.81,49.53 5.71,47.62 v5.71,44.45
N$37  (via drill 0.6 pad 0.61)
  Top 0.406: IC1.9 v15.24,61.59
  Bottom 0.406: v15.24,61.59 IC13.6
N$38  (via drill 0.6, 0.6 pad 0.61)
  Top 0.406: v78.11,65.41 IC2.27 | IC8.10 85.72,64.77 85.09,64.14 83.19,64.14 v81.92,65.41 | v68.58,8.26 74.78,8.26 76.2,9.68 76.2,10.79 74.93,12.06 62.23,12.06 60.96,13.34 45.72,13.34 43.81,15.24 42.55,15.24 41.91,14.61 41.91,6.35 v43.18,5.08 | v5.08,25.4 5.08,13.97 v8.26,10.79
  Bottom 0.406: v78.11,65.41 v81.92,65.41 81.92,73.03 78.74,76.2 72.39,76.2 71.12,74.93 37.47,74.93 36.2,76.2 10.16,76.2 3.17,69.22 3.17,55.24 5.08,53.34 5.08,50.16 6.99,48.26 6.99,27.3 v5.08,25.4 | IC9.4 v68.58,8.26 | v8.26,10.79 21.59,10.79 22.86,9.53 25.4,9.53 29.84,5.08 v43.18,5.08
N$39
  Top 0.406: IC1.26 38.1,64.14 41.27,67.31 IC7.9
N$40  (via drill 0.6)
  Top 0.406: IC16.7 v30.48,23.5 | IC1.29 v36.83,67.94 | v14.61,55.88 v9.53,50.8
  Bottom 0.406: v30.48,23.5 30.48,27.3 25.4,32.38 12.7,32.38 9.53,35.56 v9.53,50.8 | v36.83,67.94 35.56,66.67 35.56,57.78 33.66,55.88 v14.61,55.88
N$41
  Top 0.406: IC1.23 31.75,60.33 29.21,62.87 29.21,72.39 34.29,77.47 41.91,77.47 42.55,76.83 IC7.7
N$43  (via drill 0.6 pad 0.61)
  Top 0.406: IC3.1 36.2,44.45 36.83,43.81 36.83,31.11 34.92,29.21 32.38,29.21 29.21,26.04 26.67,26.04 25.4,24.77 v23.5,24.77 | v12.06,24.77 IC4.1
  Bottom 0.406: v23.5,24.77 v12.06,24.77 8.26,24.77 6.99,23.5 6.99,16.51 7.62,15.88 IC11.6
N$45  (via drill 0.6)
  Top 0.406: IC4.19 13.34,35.56 10.79,33.02 10.79,22.23 v12.06,20.95
  Bottom 0.406: v12.06,20.95 IC11.2
N$47  (via drill 0.6)
  Top 0.406: IC16.4 34.29,22.23 v35.56,23.5 | IC2.29 v78.11,67.94 | v23.5,74.93 19.68,74.93 13.34,68.58 13.34,61.59 12.06,60.33 6.99,60.33 4.45,57.78 4.45,56.52 5.71,55.24 8.89,55.24 v9.53,55.88
  Bottom 0.406: v9.53,55.88 10.79,54.61 10.79,46.35 12.06,45.09 12.06,36.83 13.97,34.92 35.94,34.92 40.01,30.86 40.01,29.47 35.56,25.03 v35.56,23.5 | v78.11,67.94 78.11,73.66 76.83,74.93 73.03,74.93 71.75,73.66 36.83,73.66 35.56,74.93 v23.5,74.93
N$71  (via drill 0.6)
  Top 0.406: IC1.11 8.26,59.05 v6.35,57.15
  Bottom 0.406: IC13.9 6.35,58.95 v6.35,57.15
N$73  (via drill 0.6 pad 0.61)
  Top 0.406: IC1.8 v16.51,62.87
  Bottom 0.406: v16.51,62.87 IC13.5
N$74  (via drill 0.6 pad 0.61)
  Top 0.406: IC1.7 17.78,64.14 v16.51,65.41
  Bottom 0.406: v16.51,65.41 IC13.3
N$75  (via drill 0.6 pad 0.61)
  Top 0.406: IC1.6 19.05,65.41 v17.78,66.67
  Bottom 0.406: v17.78,66.67 IC13.2
N$76  (via drill 0.6 pad 0.61)
  Top 0.406: v15.24,64.14 15.24,66.15 17.04,67.94 18.41,67.94 19.68,66.67 IC1.5
  Bottom 0.406: IC13.4 v15.24,64.14
N$77  (via drill 0.6 pad 0.61)
  Top 0.406: IC1.10 v16.51,60.33
  Bottom 0.406: v16.51,60.33 IC13.7
N$78  (via drill 0.6)
  Top 0.406: IC2.12 57.15,57.78 53.98,54.61 | v43.18,60.33 48.26,60.33 53.98,54.61 | 53.98,54.61 v53.98,40.01
  Bottom 0.406: v43.18,60.33 IC14.10 | v53.98,40.01 53.98,37.47 54.61,36.83 54.61,31.75 60.33,26.04 60.33,25.08 55.88,20.64 55.88,13.97 55.24,13.34 52.07,13.34 50.8,12.06 IC15.4
N$79  (via drill 0.6)
  Top 0.406: IC2.11 56.52,59.05 v55.24,57.78
  Bottom 0.406: IC14.9 45.72,59.05 46.99,57.78 v55.24,57.78
N$80  (via drill 0.6 pad 0.61)
  Top 0.406: IC2.10 v55.24,60.33
  Bottom 0.406: v55.24,60.33 IC14.7
N$81  (via drill 0.6 pad 0.61)
  Top 0.406: IC2.9 v53.98,61.59
  Bottom 0.406: v53.98,61.59 IC14.6
N$82  (via drill 0.6 pad 0.61)
  Top 0.406: IC2.8 v55.24,62.87
  Bottom 0.406: v55.24,62.87 IC14.5
N$83  (via drill 0.6 pad 0.61)
  Top 0.406: IC2.7 56.52,64.14 v55.24,65.41
  Bottom 0.406: v55.24,65.41 IC14.3
N$84  (via drill 0.6 pad 0.61)
  Top 0.406: IC2.6 57.78,65.41 v56.52,66.67
  Bottom 0.406: v56.52,66.67 IC14.2
N$85  (via drill 0.6 pad 0.61)
  Top 0.406: v53.98,64.14 53.98,66.04 55.88,67.94 57.15,67.94 58.42,66.67 IC2.5
  Bottom 0.406: IC14.4 v53.98,64.14
N$87  (via drill 0.6)
  Top 0.406: v51.44,46.35 51.44,50.16 41.27,60.33 v41.27,61.59
  Bottom 0.406: IC15.9 45.72,22.86 48.26,25.4 48.26,43.18 v51.44,46.35 | v41.27,61.59 IC14.11
N$88  (via drill 0.6)
  Top 0.406: v49.53,20.95 v43.18,20.95
  Bottom 0.406: v43.18,20.95 43.18,32 37.72,37.47 15.24,37.47 14.61,38.1 14.61,44.45 12.06,46.99 12.06,55.24 10.16,57.15 10.16,60.33 8.89,61.59 IC13.11 | IC15.12 v49.53,20.95
O1  (via drill 0.6)
  Top 0.406: v82.55,11.43 82.55,10.16 78.74,6.35 JP2.1
  Bottom 0.406: IC6.4 92.71,20.32 91.44,19.05 91.44,15.24 90.17,13.97 85.09,13.97 v82.55,11.43
O2
  Bottom 0.406: JP2.2 81.28,12.7 83.82,15.24 88.27,15.24 88.9,15.88 IC6.7
O3  (via drill 0.6)
  Top 0.406: v93.98,22.23 93.98,24.13 87.63,30.48 v85.72,30.48
  Bottom 0.406: JP2.3 83.82,10.16 86.36,12.7 92.08,12.7 92.71,13.34 92.71,18.41 93.98,19.68 v93.98,22.23 | v85.72,30.48 86.89,31.65 IC6.9
O4
  Bottom 0.406: IC6.12 91.44,30.11 92.34,29.21 97.79,29.21 97.79,16.51 92.71,11.43 87.63,11.43 86.36,10.16 JP2.4
O5  (via drill 0.6)
  Top 0.406: IC5.4 v92.71,53.98 | v99.06,45.09 99.06,15.88 96.52,13.34 91.44,13.34 88.9,10.79 JP2.5
  Bottom 0.406: v99.06,45.09 99.06,57.78 97.79,59.05 96.52,59.05 95.25,57.78 95.25,56.52 v92.71,53.98
O6  (via drill 0.6)
  Top 0.406: IC5.7 88.9,54.61 89.53,55.24 v91.44,55.24 | v100.33,43.81 100.33,14.61 97.16,11.43 92.08,11.43 91.44,10.79 JP2.6
  Bottom 0.406: v100.33,43.81 100.33,58.42 98.42,60.33 95.89,60.33 93.34,57.78 93.34,57.15 v91.44,55.24
O7  (via drill 0.6)
  Top 0.406: IC5.9 v87.63,41.91
  Bottom 0.406: v87.63,41.91 94.57,41.91 99.06,37.42 99.06,15.88 93.98,10.79 JP2.7
O8  (via drill 0.6)
  Top 0.406: IC5.12 v91.44,43.18
  Bottom 0.406: JP2.8 96.52,10.79 100.33,14.61 100.33,38.1 95.25,43.18 v91.44,43.18
SWAP  (via drill 0.6)
  Top 0.406: v85.72,17.78 86.36,17.14 v96.52,17.14 97.79,18.41 97.79,45.72 99.06,46.99 99.06,55.24 98.42,55.88 97.16,55.88 96.52,55.24 IC5.1 | IC3.19 40.64,43.18 39.37,41.91 39.37,29.84 38.1,28.57 v38.1,23.5 IC16.1 | v43.81,10.79 43.81,9.53 45.72,7.62 | 45.72,7.62 v54.61,7.62 57.78,10.79 59.69,10.79 60.96,9.53 62.87,9.53 63.5,10.16 v74.3,10.16 | 45.72,7.62 JP4.1
  Bottom 0.406: v96.52,17.14 IC6.1 | IC11.1 12.7,22.23 14.07,20.85 IC16.1 | v43.81,10.79 41.91,12.7 41.91,17.14 38.2,20.85 IC16.1 | v38.1,23.5 IC16.1 | IC15.1 v54.61,7.62 | v85.72,17.78 78.11,17.78 74.3,13.97 v74.3,10.16 72.49,10.16 IC9.1
VCC  (via drill 0.6)
  Top 0.406: IC1.32 34.29,71.75 | IC2.32 74.93,71.75 | IC2.30 73.03,69.22 72.39,69.85 72.39,71.12 73.03,71.75 74.93,71.75 | IC5.16 v96.52,36.2 96.52,19.68 95.25,18.41 87,18.41 v85.72,19.68 | 74.93,71.75 v74.93,73.66 | 34.29,71.75 v34.29,73.66 | v73.66,24.13 69.85,24.13 66.67,27.3 IC12.20 56.52,27.3 54.61,25.4 v54.61,23.5 | v38.1,69.22 IC1.30 32.38,69.22 31.75,69.85 31.75,71.12 32.38,71.75 34.29,71.75 | IC4.20 12.06,41.91 v10.79,43.18 v8.26,43.18 | IC16.16 38.1,17.14 36.83,18.41 35.56,18.41 | 35.56,18.41 IC16.3 | 35.56,18.41 33.92,18.41 33.02,19.31 IC16.5 v33.02,23.5 | v38.1,30.48 38.1,42.55 40.01,44.45 IC3.20 43.18,44.45 44.45,43.18 49.53,43.18 v50.16,42.55 | IC8.16 93.34,64.14 90.81,61.59 v80.01,61.59 | IC7.16 50.9,69.32 v52.07,70.48 | v71.12,41.91 73.66,41.91 75.56,40.01 v85.09,40.01
  Bottom 0.406: IC6.16 v96.52,36.2 92.71,40.01 v85.09,40.01 | 44.45,67.94 IC14.16 45.09,68.05 45.09,69.22 | v74.93,73.66 73.66,73.66 72.39,72.39 | 72.39,72.39 52.07,72.39 | 52.07,72.39 48.26,72.39 45.09,69.22 | v34.29,73.66 9.53,73.66 4.45,68.58 4.45,67.94 | v38.1,69.22 45.09,69.22 | JP7.1 2.54,12.06 1.27,13.34 1.27,21.33 2.17,22.23 IC11.14 3.81,22.23 8.26,26.67 v8.26,43.18 8.26,48.9 6.35,50.8 6.35,53.98 4.45,55.88 4.45,67.94 | v10.79,43.18 10.79,36.2 13.34,33.66 34.92,33.66 v38.1,30.48 33.02,25.4 v33.02,23.5 | v50.16,42.55 52.7,45.09 67.94,45.09 v71.12,41.91 | v85.72,19.68 77.47,19.68 74.19,16.41 IC9.16 72.39,22.86 v73.66,24.13 | 72.39,72.39 72.39,64.14 73.66,62.87 78.74,62.87 v80.01,61.59 | v52.07,70.48 52.07,72.39 | IC15.16 v54.61,23.5 | IC13.16 4.45,67.94
VIDEO_CLKX
  Bottom 0.406: JP5.2 66.04,4.45 64.77,5.71 59.05,5.71 55.88,8.89 55.88,11.43 55.24,12.06 52.7,12.06 52.07,11.43 IC15.3 52.07,7.62 51.44,6.99 50.16,6.99 49.53,7.62 IC15.5
VIDEO_CLKY
  Bottom 0.406: 69.85,6.35 71.12,5.08 JP5.4 | IC9.3 69.85,6.35 | IC9.5 67.31,6.99 67.94,6.35 69.85,6.35
VIDEO_ENABLE_LOW  (via drill 0.6)
  Top 0.406: IC5.15 v95.25,34.92 95.25,20.95 93.98,19.68 v87.63,19.68 | JP5.1 63.5,4.45 64.77,5.71 74.93,5.71 v76.2,4.45
  Bottom 0.406: IC6.15 v95.25,34.92 | v87.63,19.68 87.63,17.14 87,16.51 82.55,16.51 76.83,10.79 76.83,5.08 v76.2,4.45
VIDEO_RESX  (via drill 0.6)
  Top 0.406: v53.34,19.68 v57.15,19.68
  Bottom 0.406: IC15.10 46.99,22.23 48.26,23.5 50.8,23.5 52.07,22.23 52.07,19.68 | JP5.3 68.58,3.81 65.41,6.99 59.69,6.99 57.15,9.53 v57.15,19.68 | 52.07,19.68 IC15.14 | v53.34,19.68 52.07,19.68
VIDEO_RESY  (via drill 0.6)
  Top 0.406: v75.56,13.34 75.56,14.98 74.67,15.88 62.23,15.88 v61.59,15.24
  Bottom 0.406: IC9.14 69.85,20.85 67.84,22.86 62.87,22.86 60.96,20.95 60.96,15.88 v61.59,15.24 62.55,14.29 64.14,14.29 64.77,14.92 IC9.10 | JP5.5 73.66,4.45 75.56,6.35 v75.56,13.34

### Text on the board
Top: DUAL SRAM | SWAPPER | Tomas Pazdiora
Bottom: V 1.0 | 11.9. 2014